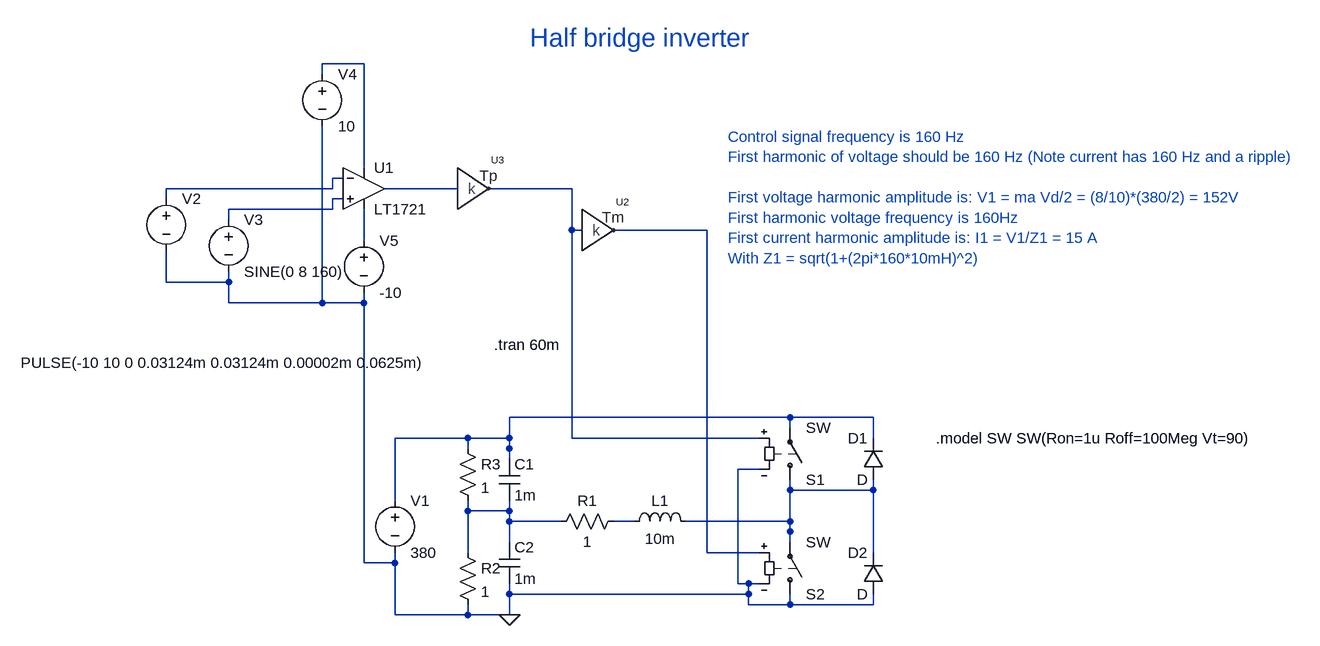
[diagram p0: schematic Half-bridge-inverter.asc]
Half-bridge-inverter.asc, the LTspice schematic file:
Version 4.1
SHEET 1 1668 680
WIRE 176 320 176 336
WIRE 736 336 736 352
WIRE 112 352 112 368
WIRE 560 144 544 144
WIRE 608 336 608 352
WIRE 560 320 544 320
WIRE 0 272 0 288
WIRE -352 -192 -352 -176
WIRE -256 -160 -256 -144
WIRE -112 -384 -112 -368
WIRE -48 -128 -48 -112
WIRE 176 336 176 368
WIRE 176 368 112 368
WIRE 112 368 0 368
WIRE 0 368 0 288
WIRE 176 336 544 336
WIRE 544 336 544 320
WIRE 544 320 544 352
WIRE 544 352 608 352
WIRE 608 352 736 352
WIRE 544 320 528 320
WIRE 528 320 528 144
WIRE 528 144 544 144
WIRE 0 288 -48 288
WIRE -48 288 -48 -112
WIRE -48 -112 -256 -112
WIRE -256 -112 -256 -144
WIRE -256 -144 -352 -144
WIRE -352 -144 -352 -176
WIRE -48 -112 -112 -112
WIRE -112 -112 -112 -368
FLAG 176 368 0
WIRE -48 -320 -48 -336
WIRE -112 -464 -112 -480
WIRE -48 -336 -48 -480
WIRE -48 -480 -112 -480
WIRE -80 -304 -96 -304
WIRE -352 -272 -352 -288
WIRE -96 -304 -96 -288
WIRE -96 -288 -352 -288
WIRE -16 -288 0 -288
WIRE 96 -288 80 -288
WIRE 0 -288 80 -288
WIRE -80 -272 -96 -272
WIRE -256 -240 -256 -256
WIRE -96 -272 -96 -256
WIRE -96 -256 -256 -256
WIRE -48 -256 -48 -240
WIRE -48 -208 -48 -224
WIRE -48 -240 -48 -224
WIRE 176 128 176 112
WIRE 736 96 736 80
WIRE 112 112 112 96
WIRE 608 80 608 64
WIRE 0 192 0 176
WIRE 176 112 176 96
WIRE 176 96 112 96
WIRE 112 96 0 96
WIRE 0 96 0 176
WIRE 176 112 176 64
WIRE 176 64 608 64
WIRE 608 64 736 64
WIRE 736 64 736 80
WIRE 176 192 176 208
WIRE 176 256 176 240
WIRE 256 224 240 224
WIRE 112 272 112 256
WIRE 112 192 112 208
WIRE 176 208 176 240
WIRE 176 208 112 208
WIRE 112 208 112 256
WIRE 176 208 176 224
WIRE 176 224 240 224
WIRE 368 224 352 224
WIRE 336 224 352 224
WIRE 736 160 736 176
WIRE 736 272 736 256
WIRE 448 224 464 224
WIRE 608 160 608 176
WIRE 608 256 608 240
WIRE 736 176 736 256
WIRE 736 176 608 176
WIRE 608 176 608 240
WIRE 608 240 608 224
WIRE 608 224 464 224
WIRE 560 272 544 272
WIRE 336 -224 352 -224
WIRE 544 272 480 272
WIRE 480 272 480 -224
WIRE 480 -224 352 -224
FLAG 336 -224 Tm
WIRE 560 96 544 96
WIRE 288 -224 272 -224
WIRE 144 -288 160 -288
WIRE 544 96 272 96
WIRE 272 96 272 -224
WIRE 272 -224 272 -288
WIRE 272 -288 160 -288
FLAG 144 -288 Tp
SYMBOL voltage 0 176 R0
WINDOW 123 0 0 Left 0
WINDOW 39 0 0 Left 0
SYMATTR InstName V1
SYMATTR Value 380
SYMBOL cap 160 128 R0
SYMATTR InstName C1
SYMATTR Value 1m
SYMATTR SpiceLine Rser=1m Rpar=1Meg
SYMBOL cap 160 256 R0
SYMATTR InstName C2
SYMATTR Value 1m
SYMATTR SpiceLine Rser=1m Rpar=1Meg
SYMBOL res 352 208 R90
WINDOW 0 0 56 VBottom 2
WINDOW 3 32 56 VTop 2
SYMATTR InstName R1
SYMATTR Value 1
SYMBOL ind 352 240 R270
WINDOW 0 32 56 VTop 2
WINDOW 3 5 56 VBottom 2
SYMATTR InstName L1
SYMATTR Value 10m
SYMBOL sw 608 176 M180
SYMATTR InstName S1
SYMBOL diode 752 160 R180
WINDOW 0 24 64 Left 2
WINDOW 3 24 0 Left 2
SYMATTR InstName D1
SYMBOL sw 608 352 M180
SYMATTR InstName S2
SYMBOL diode 752 336 R180
WINDOW 0 24 64 Left 2
WINDOW 3 24 0 Left 2
SYMATTR InstName D2
SYMBOL voltage -256 -256 R0
WINDOW 123 0 0 Left 0
WINDOW 39 0 0 Left 0
SYMATTR InstName V3
SYMATTR Value SINE(0 8 160)
SYMBOL Comparators\\LT1721 -48 -352 R0
SYMATTR InstName U1
SYMBOL voltage -112 -480 R0
WINDOW 123 0 0 Left 0
WINDOW 39 0 0 Left 0
SYMATTR InstName V4
SYMATTR Value 10
SYMBOL voltage -48 -224 R0
WINDOW 123 0 0 Left 0
WINDOW 39 0 0 Left 0
SYMATTR InstName V5
SYMATTR Value -10
SYMBOL Gain 304 -224 R0
SYMATTR InstName U2
SYMBOL voltage -352 -288 R0
WINDOW 3 -224 268 Left 2
WINDOW 123 0 0 Left 0
WINDOW 39 0 0 Left 0
SYMATTR Value PULSE(-10 10 0 0.03124m 0.03124m 0.00002m 0.0625m)
SYMATTR InstName V2
SYMBOL Gain 112 -288 R0
SYMATTR SpiceLine G=100
SYMATTR InstName U3
SYMBOL res 96 256 R0
SYMATTR InstName R2
SYMATTR Value 1
SYMBOL res 96 96 R0
SYMATTR InstName R3
SYMATTR Value 1
TEXT 832 96 Left 2 !.model SW SW(Ron=1u Roff=100Meg Vt=90)
TEXT 152 -48 Left 2 !.tran 60m
TEXT 512 -368 Left 2 ;Control signal frequency is 160 Hz\nFirst harmonic of voltage should be 160 Hz (Note current has 160 Hz and a ripple)\n \nFirst voltage harmonic amplitude is: V1 = ma Vd/2 = (8/10)*(380/2) = 152V\nFirst harmonic voltage frequency is 160Hz\nFirst current harmonic amplitude is: I1 = V1/Z1 = 15 A\nWith Z1 = sqrt(1+(2pi*160*10mH)^2)
TEXT 208 -520 Left 4 ;Half bridge inverter

The netlist it stands for:
* Half-bridge-inverter.asc
V1 N006 0 380
C1 N006 N007 1m Rser=1m Rpar=1Meg
C2 N007 0 1m Rser=1m Rpar=1Meg
R1 N008 N007 1
L1 N008 N009 10m
S1 N009 N006 Tp 0 SW
D1 N009 N006 D
S2 0 N009 Tm 0 SW
D2 0 N009 D
V3 N004 0 SINE(0 8 160)
X§U1 N004 N002 N001 N005 N003 LT1720  ; LT1721, pins In+ In- V+ V- OUT
V4 N001 0 10
V5 N005 0 -10
E§U2 Tp Tm G={G}
V2 N002 0 PULSE(-10 10 0 0.03124m 0.03124m 0.00002m 0.0625m)
E§U3 N003 Tp G={G} G=100
R2 N007 0 1
R3 N006 N007 1
.model D D
.lib standard.dio
.model SW SW(Ron=1u Roff=100Meg Vt=90)
.tran 60m
* Control signal frequency is 160 Hz
* First harmonic of voltage should be 160 Hz (Note current has 160 Hz and a ripple)
* First voltage harmonic amplitude is: V1 = ma Vd/2 = (8/10)*(380/2) = 152V
* First harmonic voltage frequency is 160Hz
* First current harmonic amplitude is: I1 = V1/Z1 = 15 A
* With Z1 = sqrt(1+(2pi*160*10mH)^2)
* Half bridge inverter
.lib LTC.lib
.backanno
.end